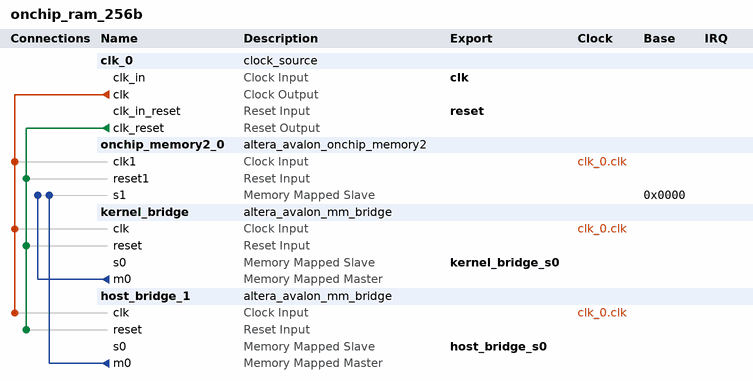
[diagram p0: system contents]
# Platform Designer (Qsys) system onchip_ram_256b, Cyclone V 5CEBA2F17A7
# Parameters at their usual value, and those the tool derives, are not listed.
package require -exact qsys 15.1
create_system onchip_ram_256b
set_project_property DEVICE_FAMILY {Cyclone V}
set_project_property DEVICE 5CEBA2F17A7

add_instance clk_0 clock_source 15.1
set_instance_parameter_value clk_0 clockFrequency 50000000

add_instance onchip_memory2_0 altera_avalon_onchip_memory2 15.1
set_instance_parameter_value onchip_memory2_0 dataWidth 256
set_instance_parameter_value onchip_memory2_0 dualPort false
set_instance_parameter_value onchip_memory2_0 initMemContent true
set_instance_parameter_value onchip_memory2_0 initializationFileName onchip_mem.hex
set_instance_parameter_value onchip_memory2_0 memorySize 8388608
set_instance_parameter_value onchip_memory2_0 resetrequest_enabled false

add_instance kernel_bridge altera_avalon_mm_bridge 15.1
set_instance_parameter_value kernel_bridge ADDRESS_UNITS SYMBOLS
set_instance_parameter_value kernel_bridge ADDRESS_WIDTH 10
set_instance_parameter_value kernel_bridge DATA_WIDTH 256
set_instance_parameter_value kernel_bridge MAX_BURST_SIZE 16
set_instance_parameter_value kernel_bridge MAX_PENDING_RESPONSES 4
set_instance_parameter_value kernel_bridge USE_AUTO_ADDRESS_WIDTH 1

add_instance host_bridge_1 altera_avalon_mm_bridge 15.1
set_instance_parameter_value host_bridge_1 ADDRESS_UNITS SYMBOLS
set_instance_parameter_value host_bridge_1 ADDRESS_WIDTH 10
set_instance_parameter_value host_bridge_1 DATA_WIDTH 32
set_instance_parameter_value host_bridge_1 MAX_PENDING_RESPONSES 4
set_instance_parameter_value host_bridge_1 USE_AUTO_ADDRESS_WIDTH 1

# connections
add_connection clk_0.clk host_bridge_1.clk clock
add_connection clk_0.clk kernel_bridge.clk clock
add_connection clk_0.clk onchip_memory2_0.clk1 clock
add_connection clk_0.clk_reset host_bridge_1.reset reset
add_connection clk_0.clk_reset kernel_bridge.reset reset
add_connection clk_0.clk_reset onchip_memory2_0.reset1 reset
add_connection host_bridge_1.m0 onchip_memory2_0.s1 avalon
set_connection_parameter_value host_bridge_1.m0/onchip_memory2_0.s1 baseAddress 0x0000
add_connection kernel_bridge.m0 onchip_memory2_0.s1 avalon
set_connection_parameter_value kernel_bridge.m0/onchip_memory2_0.s1 baseAddress 0x0000

# exported interfaces
add_interface clk clock sink
set_interface_property clk EXPORT_OF clk_0.clk_in
add_interface host_bridge_s0 avalon slave
set_interface_property host_bridge_s0 EXPORT_OF host_bridge_1.s0
add_interface kernel_bridge_s0 avalon slave
set_interface_property kernel_bridge_s0 EXPORT_OF kernel_bridge.s0
add_interface reset reset sink
set_interface_property reset EXPORT_OF clk_0.clk_in_reset

set_interconnect_requirement {$system} qsys_mm.clockCrossingAdapter HANDSHAKE
set_interconnect_requirement {$system} qsys_mm.enableEccProtection FALSE
set_interconnect_requirement {$system} qsys_mm.insertDefaultSlave FALSE
set_interconnect_requirement {$system} qsys_mm.maxAdditionalLatency 1

save_system onchip_ram_256b.qsys
